# EAGLE design board (EAGLE 8.3.1)
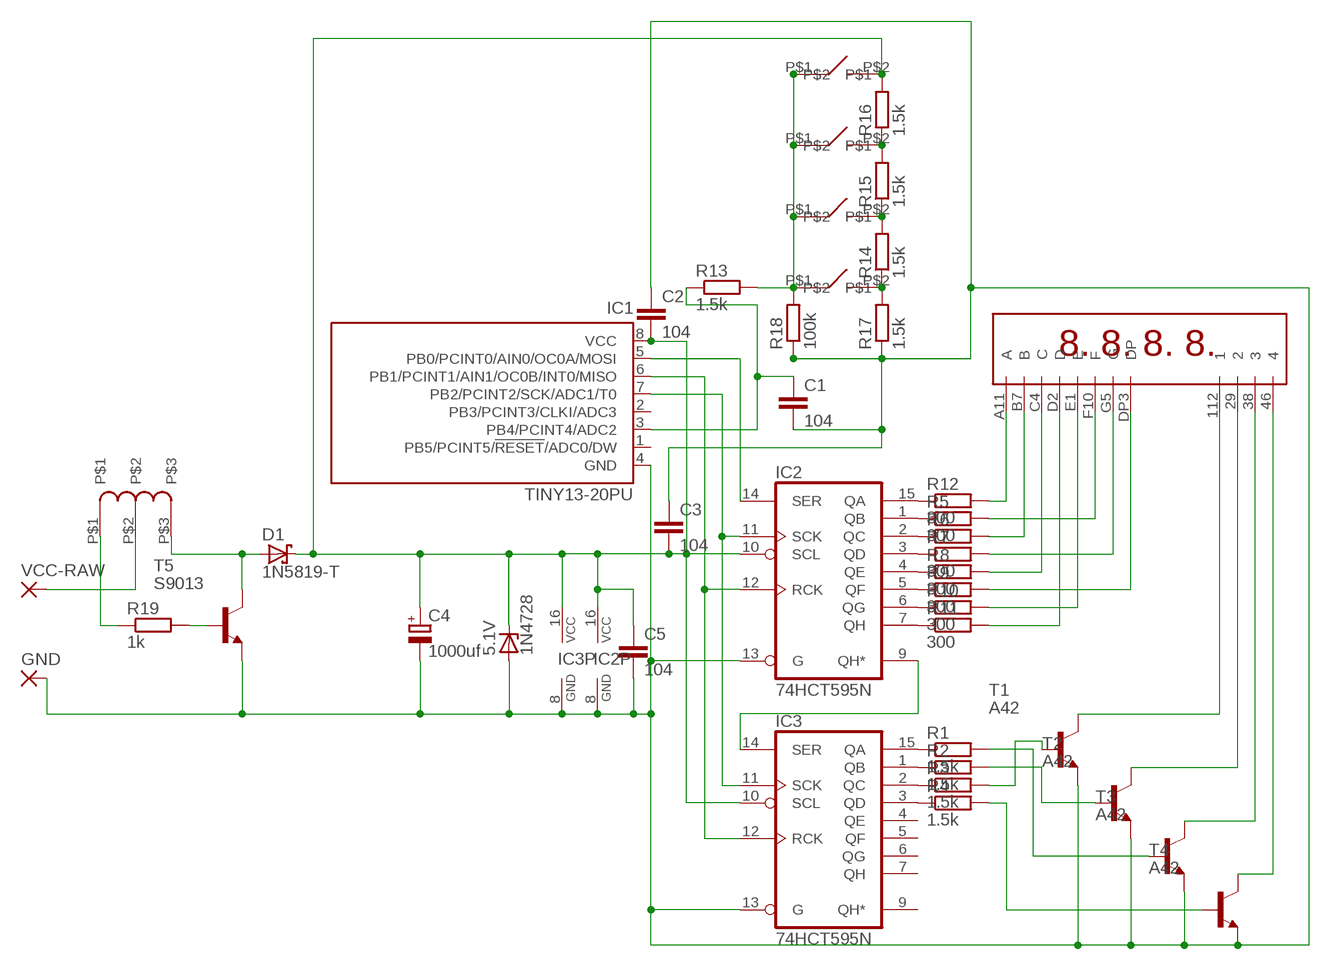
[diagram p0: schematic, sheet 1]

## Parts
5.1V  1N4728  [DO41Z10]
BTN1  BTN-6X6  [BTN-6X6]
BTN2  BTN-6X6  [BTN-6X6]
BTN3  BTN-6X6  [BTN-6X6]
BTN4  BTN-6X6  [BTN-6X6]
C1  104  C-EU050-025X075  [C050-025X075]
C2  104  C-EU050-025X075  [C050-025X075]
C3  104  C-EU050-025X075  [C050-025X075]
C4  1000uf  CPOL-EUE3.5-8  [E3,5-8]
C5  104  C-EU050-025X075  [C050-025X075]
D1  1N5819-T  [DO41-7.6]
GND  2,54/0,8  [2,54/0,8]
IC1  TINY13-20PU  [DIL08]
IC2  74HCT595N  [DIL16]
IC3  74HCT595N  [DIL16]
R1  1.5k  R-EU_0207/2V  [0207/2V]
R2  1.5k  R-EU_0207/2V  [0207/2V]
R3  1.5k  R-EU_0207/2V  [0207/2V]
R4  1.5k  R-EU_0207/2V  [0207/2V]
R5  300  R-EU_0207/2V  [0207/2V]
R6  R-EU_0207/2V  [0207/2V]
R7  300  R-EU_0207/2V  [0207/2V]
R8  300  R-EU_0207/2V  [0207/2V]
R9  300  R-EU_0207/2V  [0207/2V]
R10  300  R-EU_0207/2V  [0207/2V]
R11  300  R-EU_0207/2V  [0207/2V]
R12  300  R-EU_0207/2V  [0207/2V]
R13  1.5k  R-EU_0204/7  [0204/7]
R14  1.5k  R-EU_0204/7  [0204/7]
R15  1.5k  R-EU_0204/7  [0204/7]
R16  1.5k  R-EU_0204/7  [0204/7]
R17  1.5k  R-EU_0204/7  [0204/7]
R18  100k  R-EU_0204/7  [0204/7]
R19  1k  R-EU_0207/2V  [0207/2V]
T1  A42  MPSA42-NPN-TO92-EBC  [TO92-EBC]
T2  A42  MPSA42-NPN-TO92-EBC  [TO92-EBC]
T3  A42  MPSA42-NPN-TO92-EBC  [TO92-EBC]
T4  A42  MPSA42-NPN-TO92-EBC  [TO92-EBC]
T5  S9013  MPSA42-NPN-TO92-EBC  [TO92-EBC]
U$1  KL-5641-ASR  [KL-5641-ASR]
U$3  TRANS  [TRANS]
VCC-RAW  2,54/0,8  [2,54/0,8]

## Nets
GND: 5.1V.A C1.2 C2.1 C3.1 C4.- C5.2 GND.1(P) IC1.4(GND) IC2.8(GND) IC2.13(G) IC3.8(GND) IC3.13(G) R17.1 R18.1 T1.E T2.E T3.E T4.E T5.E
N$1: R10.2 U$1.E1(E)
N$2: R11.2 U$1.D2(D)
N$3: R9.2 U$1.DP3(DP)
N$4: R8.2 U$1.C4(C)
N$5: R7.2 U$1.G5(G)
N$6: R6.2 U$1.B7(B)
N$7: R5.2 U$1.F10(F)
N$8: R12.2 U$1.A11(A)
N$9: IC2.9(QH*) IC3.14(SER)
N$10: IC3.15(QA) R1.1
N$11: R1.2 T3.B
N$12: R2.2 T2.B
N$13: R4.2 T4.B
N$15: T1.C U$1.112
N$16: T2.C U$1.29
N$17: T3.C U$1.38
N$18: T4.C U$1.46
N$19: IC1.5(PB0/PCINT0/AIN0/OC0A/MOSI) IC2.14(SER)
N$22: D1.A T5.C U$3.P$3
N$23: IC3.1(QB) R2.1
N$24: IC3.2(QC) R3.1
N$25: IC3.3(QD) R4.1
N$26: R3.2 T1.B
N$27: IC2.7(QH) R11.1
N$28: IC2.6(QG) R10.1
N$29: IC2.5(QF) R9.1
N$30: IC2.4(QE) R8.1
N$31: IC2.3(QD) R7.1
N$32: IC2.2(QC) R6.1
N$33: IC2.1(QB) R5.1
N$34: IC2.15(QA) R12.1
N$35: C1.1 IC1.3(PB4/PCINT4/ADC2) R13.1
N$36: BTN1.P$1 BTN2.P$1 BTN3.P$1 BTN4.P$1 R13.2 R18.2
N$37: BTN4.P$2 R14.1 R17.2
N$38: BTN3.P$2 R14.2 R15.1
N$39: BTN2.P$2 R15.2 R16.1
N$41: R19.2 T5.B
N$43: R19.1 U$3.P$1
RCK: IC1.6(PB1/PCINT1/AIN1/OC0B/INT0/MISO) IC2.12(RCK) IC3.12(RCK)
SCK: IC1.7(PB2/PCINT2/SCK/ADC1/T0) IC2.11(SCK) IC3.11(SCK)
VCC: 5.1V.C BTN1.P$2 C2.2 C3.2 C4.+ C5.1 D1.C IC1.8(VCC) IC2.10(SCL) IC2.16(VCC) IC3.10(SCL) IC3.16(VCC) R16.2
VCC-RAW: U$3.P$2 VCC-RAW.1(P)
Unconnected: IC1.1(PB5/PCINT5/!RESET!/ADC0/DW) IC1.2(PB3/PCINT3/CLKI/ADC3) IC3.4(QE) IC3.5(QF) IC3.6(QG) IC3.7(QH) IC3.9(QH*)

## Library data of the parts
5.1V = diode:1N4728: Z DIODE 3.3 V, 1W, 5 percent
BTN1-BTN4 = mgvc:BTN-6X6
C1-C3 C5 = resistor:C-EU: CAPACITOR, European symbol
C4 = resistor:CPOL-EU: POLARIZED CAPACITOR, European symbol
D1 = diode:1N581*: 1.0A SCHOTTKY BARRIER RECTIFIER Source: http://www.diodes.com/datasheets/ds23001.pdf
GND VCC-RAW = wirepad:2,54/0,8: THROUGH-HOLE PAD
IC1 = atmel:TINY13: 8-bit AVR Microcontroller with 1K Bytes In-System Programmable Flash Source: http://www.atmel.com/dyn/resources/prod_documents/2535S.pdf; MPN: ATTINY13-20PU; OC_FARNELL: 9171550; OC_NEWARK: 96K6521
IC2 IC3 = 74xx-eu:74*595: 8-bit SHIFT REGISTER, output latch
R1-R19 = resistor:R-EU_: RESISTOR, European symbol
T1-T5 = transistor:*-NPN-: NPN Transistror BF959 corrected 2008.03.06
U$1 = mgvc:KL-5641-ASR: Индикатор 4 разряда 0.56" Красный, катод, черный фон KL-5641-ASR
U$3 = mgvc:TRANS

## Board
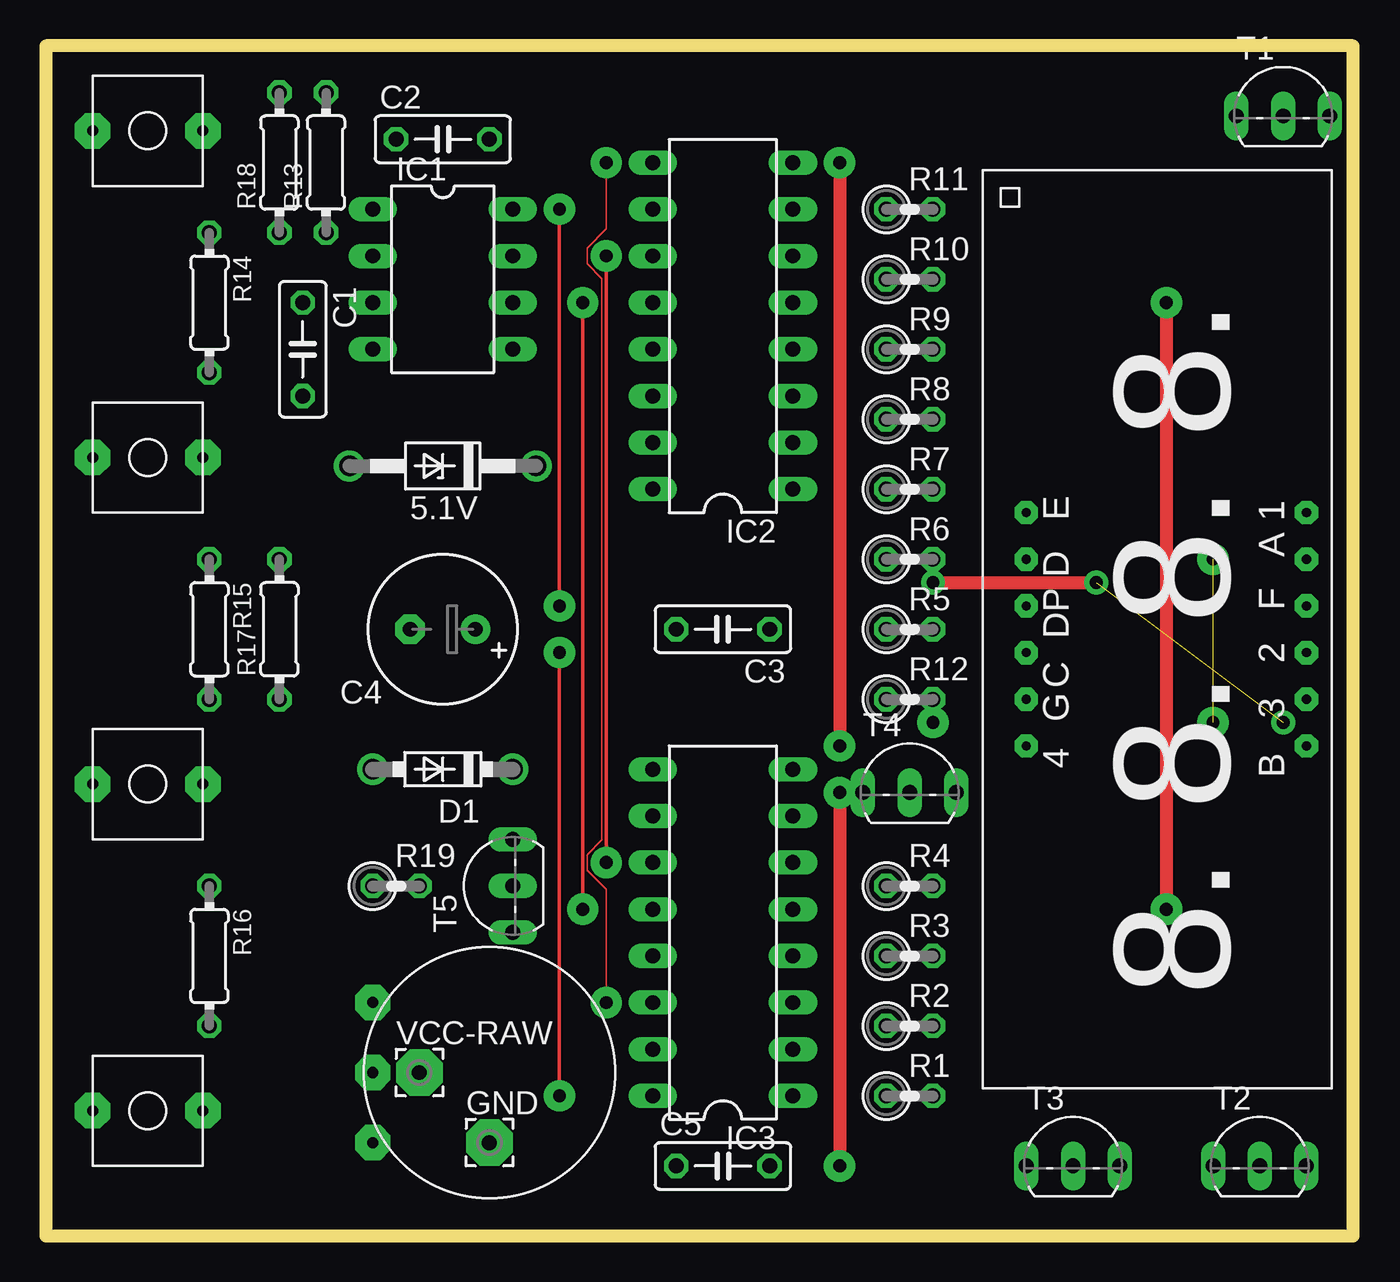
[diagram p1: board, top side]
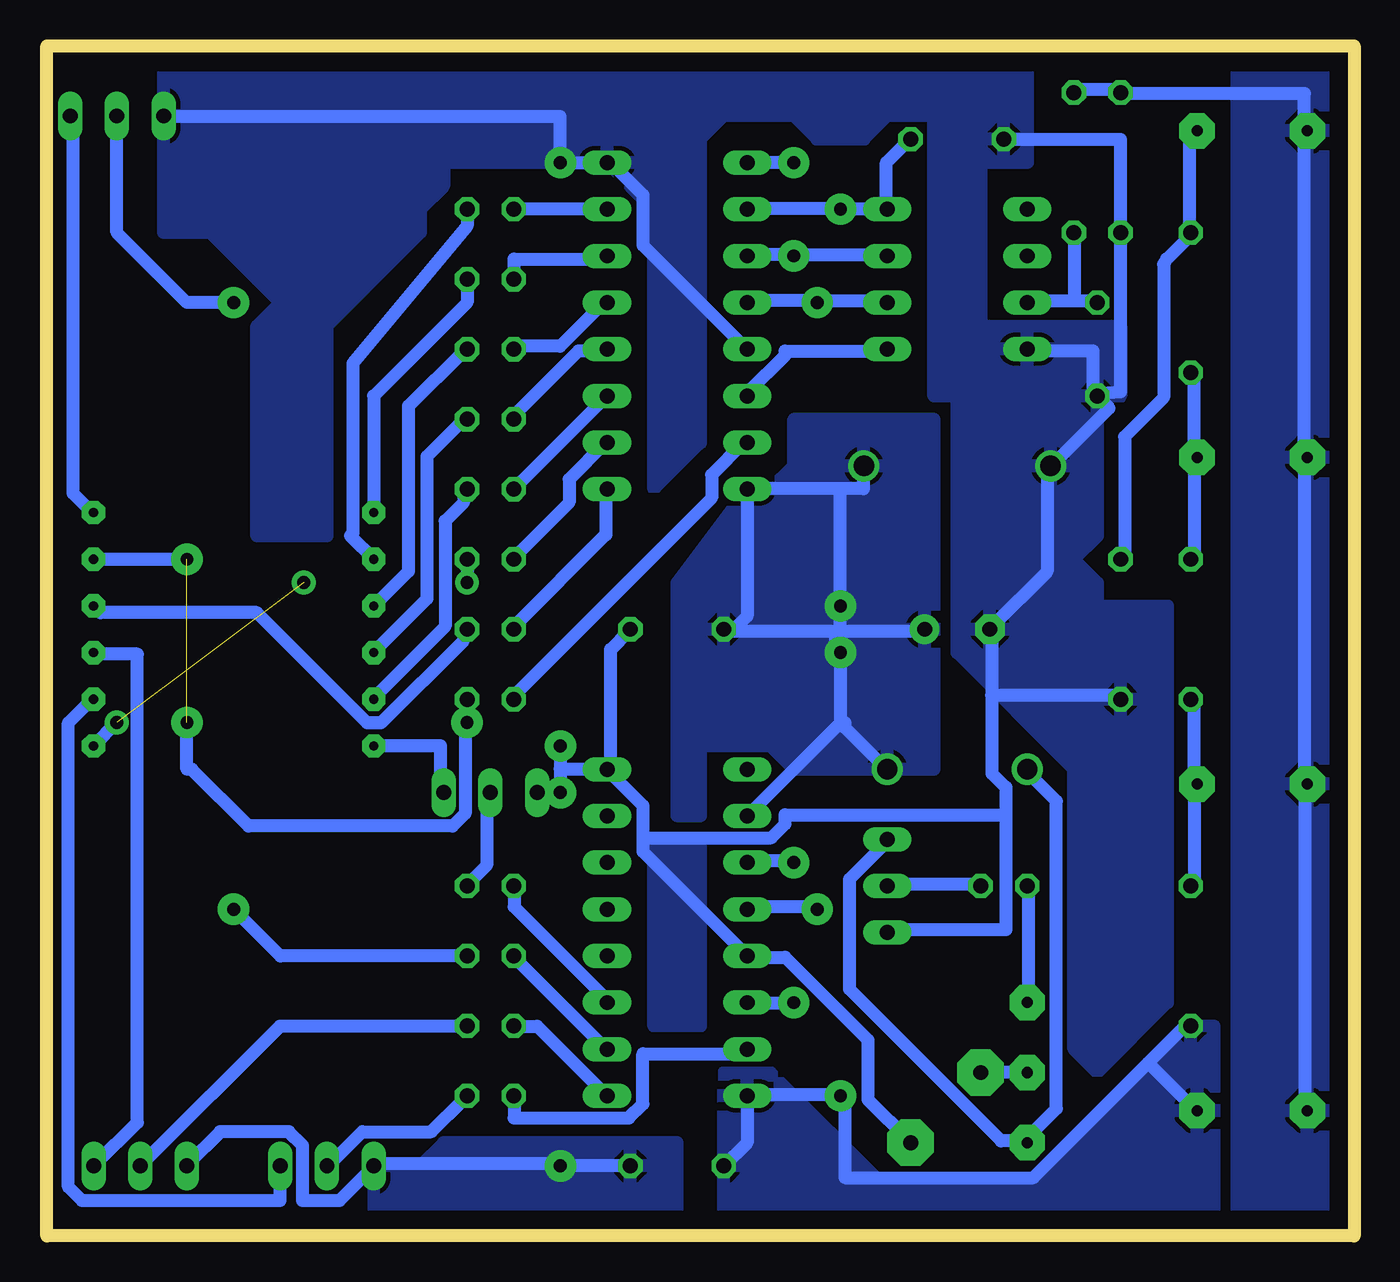
[diagram p2: board, bottom side, seen from below]

Size 71.12 x 64.77 mm. Coordinates in mm from the lower left corner, seen from the top.
Outline: 0,0 71.12,0 71.12,64.77 0,64.77 0,0
Copper layers (1*16): Top 0.035mm / dielectric 1.5mm / Bottom 0.035mm
Design rules "default *": minimum track width 0.7mm, minimum drill 0.35mm, track to track 6mil, track to pad 6mil, pad to pad 6mil, via to via 6mil, smd to smd 6mil, copper to edge 40mil, drill to drill 6mil, minimum pad ring 10mil, minimum via ring 8mil, stop-mask expansion 4mil, vias tented up to drill 0mil, thermal gap 10mil

### Footprints (pad centres in the part's own frame; a part is rotated, then mirrored left to right if it is on the bottom)
DO41Z10 = drill 1.118: A 5.08,0; C -5.08,0
BTN-6X6 = drill 0.6 pad 1.93 octagon: P$1 0,3; P$2 6,3
C050-025X075 = drill 0.813 octagon: 1 -2.54,0; 2 2.54,0
E3,5-8 = drill 0.813 pad 1.6: + -1.778,0 | drill 0.813 pad 1.6 octagon: - 1.778,0
DO41-7.6 = drill 1.1 pad 1.7: A 3.81,0; C -3.81,0
2,54/0,8 = drill 0.813 pad 2.54 octagon: 1 0,0
DIL08 = drill 0.813 long: 1 -3.81,-3.81; 2 -1.27,-3.81; 3 1.27,-3.81; 4 3.81,-3.81; 5 3.81,3.81; 6 1.27,3.81; 7 -1.27,3.81; 8 -3.81,3.81
DIL16 = drill 0.813 long: 1 -8.89,-3.81; 2 -6.35,-3.81; 3 -3.81,-3.81; 4 -1.27,-3.81; 5 1.27,-3.81; 6 3.81,-3.81; 7 6.35,-3.81; 8 8.89,-3.81; 9 8.89,3.81; 10 6.35,3.81; 11 3.81,3.81; 12 1.27,3.81; 13 -1.27,3.81; 14 -3.81,3.81; 15 -6.35,3.81; 16 -8.89,3.81
0207/2V = drill 0.813 octagon: 1 -1.27,0; 2 1.27,0
0204/7 = drill 0.813 octagon: 1 -3.81,0; 2 3.81,0
TO92-EBC = drill 0.813 long: B 0,-1.27; C 2.54,-1.27; E -2.54,-1.27
KL-5641-ASR = drill 0.5 pad 1.27 octagon: 29 1.27,7.62; 38 3.81,7.62; 46 6.35,-7.62; 112 -6.35,7.62; A11 -3.81,7.62; B7 6.35,7.62; C4 1.27,-7.62; D2 -3.81,-7.62; DP3 -1.27,-7.62; E1 -6.35,-7.62; F10 -1.27,7.62; G5 3.81,-7.62
TRANS = drill 0.6 pad 1.93 octagon: P$1 -6.35,3.81; P$2 -6.35,0; P$3 -6.35,-3.81

### Placement (x,y rotation side)
5.1V  21.59,41.91 180 top
BTN1  2.54,3.81 0 top
BTN2  2.54,21.59 0 top
BTN3  2.54,39.37 0 top
BTN4  2.54,57.15 0 top
C1  13.97,48.26 270 top
C2  21.59,59.69 0 top
C3  36.83,33.02 180 top
C4  21.59,33.02 180 top
C5  36.83,3.81 0 top
D1  21.59,25.4 180 top
GND  24.13,5.08 0 top
IC1  21.59,52.07 270 top
IC2  36.83,49.53 90 top
IC3  36.83,16.51 90 top
R1  46.99,7.62 0 top
R2  46.99,11.43 0 top
R3  46.99,15.24 0 top
R4  46.99,19.05 0 top
R5  46.99,33.02 0 top
R6  46.99,36.83 0 top
R7  46.99,40.64 0 top
R8  46.99,44.45 0 top
R9  46.99,48.26 0 top
R10  46.99,52.07 0 top
R11  46.99,55.88 0 top
R12  46.99,29.21 0 top
R13  15.24,58.42 90 top
R14  8.89,50.8 270 top
R15  8.89,33.02 270 top
R16  8.89,15.24 270 top
R17  12.7,33.02 90 top
R18  12.7,58.42 90 top
R19  19.05,19.05 0 top
T1  67.31,62.23 0 top
T2  66.04,5.08 0 top
T3  55.88,5.08 0 top
T4  46.99,25.4 0 top
T5  24.13,19.05 90 top
U$1  60.96,33.02 270 top
U$3  24.13,8.89 0 top
VCC-RAW  20.32,8.89 0 top

### Tracks (layer width: path | path; a pad name or v marks a point on that pad's centre or on a via)
GND  (via drill 0.7 pad 1.7)
  Top 0.7: v43.18,58.42 v43.18,26.67 | v43.18,24.13 v43.18,3.81
  Bottom 0.7: 18.95,22.92 18.95,24.42 19.7,25.17 19.7,29.44 | 18.95,22.92 18.95,16.67 25.2,16.67 T5.E | 19.7,29.44 19.7,32.92 C4.- 19.7,33.17 16.7,36.17 16.7,41.67 5.1V.A 16.45,41.92 13.32,45.05 13.95,45.67 | 13.95,45.67 14.1,45.82 12.7,45.94 R18.1 12.7,59.67 18.95,59.67 C2.1 | 12.7,29.42 R17.1 12.91,29.44 19.7,29.44 | 13.95,45.67 C1.2 14.2,45.92 14.2,48.17 17.7,48.17 IC1.4 | 38.7,21.67 38.7,23.42 40.45,25.17 IC3.8 | 38.7,21.67 38.7,20.92 IC3.13 32.7,15.17 30.95,15.17 26.45,10.67 26.45,7.42 24.2,5.17 GND.1 | C3.1 39.45,32.92 40.45,31.92 40.45,25.67 IC3.8 | T4.E 44.45,24.17 43.2,24.17 v43.18,24.13 43.2,24.42 43.2,25.42 | IC2.13 33.2,48.42 38.7,53.92 38.7,56.67 40.45,58.42 IC2.8 v43.18,58.42 43.2,58.42 43.2,60.92 64.7,60.92 T1.E | 43.2,25.42 43.2,26.67 v43.18,26.67 | 43.2,25.42 40.95,25.42 IC3.8 | 18.95,22.92 30.95,22.92 30.95,22.42 31.7,21.67 38.7,21.67 | 19.73,29.44 19.7,29.44 | T2.E 63.45,3.92 61.7,5.67 57.95,5.67 57.2,4.92 57.2,1.92 55.2,1.92 53.45,3.67 T3.E 53.2,3.92 43.2,3.92 v43.18,3.81 C5.2
  pour Bottom: 64.77,54.61 64.77,63.5 17.78,63.5 17.78,58.42 20.32,58.42 20.32,49.53 12.7,49.53 12.7,45.72 13.97,44.45 13.97,38.1 15.24,36.83 13.97,35.56 13.97,34.29 11.43,34.29 10.16,34.29 10.16,12.7 13.97,8.89 15.24,10.16 15.24,25.4 21.59,31.75 21.59,45.72 22.86,45.72 22.86,60.96 25.4,60.96 26.67,59.69 29.21,59.69 30.48,60.96 34.29,60.96 35.56,59.69 35.56,43.18 38.1,40.64 38.1,55.88 39.37,57.15 40.64,58.42 49.53,58.42 49.53,57.15 50.8,55.88 50.8,54.61 55.88,49.53 55.88,38.1 59.69,38.1 59.69,49.53 58.42,50.8 59.69,52.07 62.23,54.61
  pour Bottom: 53.34,1.27 36.83,1.27 36.83,5.08 49.53,5.08 50.8,3.81 53.34,3.81
  pour Bottom: 35.56,21.59 35.56,11.43 38.1,11.43 38.1,21.59
N$1
  Bottom 0.7: R10.2 48.26,50.8 53.34,45.72 U$1.E1
N$2
  Bottom 0.7: R11.2 48.26,54.98 54.48,47.5 54.48,38.23 54.61,38.1 U$1.D2
N$3
  Bottom 0.7: U$1.DP3 53.2,34.42 51.45,36.17 51.45,45.17 48.45,48.17 R9.2
N$4
  Bottom 0.7: U$1.C4 53.2,31.92 50.45,34.67 50.45,42.42 48.45,44.42 R8.2
N$5
  Bottom 0.7: U$1.G5 53.2,29.42 49.45,33.17 49.45,38.92 48.45,39.92 48.45,40.42 R7.2
N$6  (via drill 0.7 pad 1.3)  (1 unrouted)
  Top 0.7: v48.26,35.56 v57.15,35.56
  Bottom 0.7: R6.2 v48.26,35.56 | v67.31,27.94 U$1.B7
N$7
  Bottom 0.7: U$1.F10 68.45,34.17 68.2,33.92 59.7,33.92 53.7,27.92 52.95,27.92 48.45,32.42 48.45,32.92 R5.2
N$8  (via drill 0.7 pad 1.7)  (1 unrouted)
  Bottom 0.7: U$1.A11 v63.5,36.83 | v63.5,27.94 63.5,25.4 63.23,25.4 60.14,22.31 49.05,22.31 48.37,22.99 48.37,27.83 v48.26,27.94 R12.2
N$9  (via drill 0.7 pad 1.7)
  Top 0.076: v30.48,12.7 30.48,18.85 29.44,19.89 29.44,20.75 30.25,21.56 30.25,52.1 29.44,52.91 29.44,53.77 30.48,54.81 v30.48,58.42
  Bottom 0.7: IC3.14 32.95,12.67 30.7,12.67 v30.48,12.7 | v30.48,58.42 IC2.9
N$10
  Bottom 0.7: IC3.15 33.2,9.92 38.7,9.92 38.7,7.17 39.45,6.42 45.7,6.42 45.7,7.42 R1.1
N$11
  Bottom 0.7: R1.2 48.45,7.42 50.2,5.67 53.95,5.67 55.7,3.92 T3.B
N$12
  Bottom 0.7: T2.B 65.95,3.92 58.45,11.42 48.45,11.42 R2.2
N$13
  Bottom 0.7: R4.2 48.2,19.17 47.2,20.17 47.2,23.92 T4.B
N$15
  Bottom 0.7: U$1.112 68.7,39.42 69.7,40.42 69.7,60.92 T1.C
N$16
  Bottom 0.7: U$1.29 68.45,31.67 66.2,31.67 66.2,6.17 68.45,3.92 T2.C
N$17
  Bottom 0.7: U$1.38 68.7,29.17 69.95,27.92 69.95,2.67 69.2,1.92 58.45,1.92 58.45,3.67 T3.C
N$18
  Bottom 0.7: U$1.46 49.7,26.67 49.7,24.17 T4.C
N$19
  Bottom 0.7: IC1.5 25.45,48.17 30.95,48.17 30.95,47.92 32.95,45.92 IC2.14
N$22
  Bottom 0.7: T5.C 25.45,21.42 27.45,19.42 27.45,13.42 19.2,5.17 17.95,5.17 U$3.P$3 17.7,5.42 16.2,6.92 16.2,23.67 17.7,25.17 D1.A
N$23
  Bottom 0.7: IC3.1 40.7,7.67 44.45,11.42 45.7,11.42 R2.1
N$24
  Bottom 0.7: IC3.2 40.7,10.17 45.7,15.17 R3.1
N$25
  Bottom 0.7: IC3.3 40.7,12.92 45.7,17.92 45.7,18.92 R4.1
N$26  (via drill 0.7 pad 1.7)
  Top 0.7: v60.96,50.8 v60.96,17.78
  Bottom 0.7: 48.45,15.42 R3.2 58.42,15.24 v60.96,17.78 | 67.2,60.92 T1.B 67.31,54.61 63.5,50.8 v60.96,50.8
N$27
  Bottom 0.7: IC2.7 40.7,55.92 45.7,55.92 R11.1
N$28
  Bottom 0.7: IC2.6 40.7,53.17 45.7,53.17 45.7,52.17 R10.1
N$29
  Bottom 0.7: R9.1 45.7,48.42 43.2,48.42 40.7,50.92 IC2.5
N$30
  Bottom 0.7: R8.1 45.7,44.67 42.2,48.17 40.7,48.17 IC2.4
N$31
  Bottom 0.7: R7.1 45.7,40.67 40.7,45.67 IC2.3
N$32
  Bottom 0.7: R6.1 45.7,36.92 42.7,39.92 42.7,41.17 40.7,43.17 IC2.2
N$33
  Bottom 0.7: R5.1 45.7,33.17 40.7,38.17 40.7,40.42 IC2.1
N$34
  Bottom 0.7: R12.1 45.7,29.42 34.95,40.17 34.95,41.42 33.2,43.17 IC2.15
N$35
  Bottom 0.7: 15.2,50.92 17.7,50.92 IC1.3 | 15.2,50.92 14.2,50.92 C1.1 | 15.2,50.92 15.2,54.42 R13.1
N$36
  Bottom 0.7: R13.2 15.2,62.42 12.7,62.42 R18.2 12.45,62.17 2.7,62.17 2.7,60.17 BTN4.P$1 2.7,59.92 2.7,42.67 BTN3.P$1 2.7,42.17 2.7,24.67 BTN2.P$1 | 2.45,24.42 BTN2.P$1 | BTN1.P$1 2.69,6.85 2.69,24.33 BTN2.P$1
  pour Bottom: 6.35,1.27 6.35,63.5 1.27,63.5 1.27,1.27
N$37
  Bottom 0.7: 12.7,36.67 R17.2 12.49,37.11 12.49,43.51 10.36,45.64 10.36,52.88 10.2,53.17 8.95,54.42 R14.1 8.95,54.92 8.95,59.67 8.7,59.92 BTN4.P$2
N$38
  Bottom 0.7: R15.1 8.7,36.92 8.7,42.17 BTN3.P$2 8.7,42.67 8.7,46.92 R14.2
N$39
  Bottom 0.7: R16.1 8.7,19.17 8.7,24.42 BTN2.P$2 8.7,24.92 8.7,29.17 R15.2
N$41
  Bottom 0.7: R19.2 20.45,19.17 25.2,19.17 T5.B
N$43
  Bottom 0.7: R19.1 17.7,18.92 17.7,12.92 U$3.P$1
RCK  (via drill 0.7 pad 1.7)
  Top 0.2: v29.21,50.8 v29.21,17.78
  Bottom 0.7: IC3.12 32.95,17.92 29.45,17.92 v29.21,17.78 | IC1.6 25.45,50.92 29.2,50.92 v29.21,50.8 29.45,50.92 32.95,50.92 IC2.12
SCK  (via drill 0.7 pad 1.7)
  Top 0.2: v30.48,53.34 v30.48,20.32
  Bottom 0.7: IC3.11 32.95,20.42 30.7,20.42 v30.48,20.32 | IC1.7 25.45,53.42 30.45,53.42 v30.48,53.34 30.7,53.42 32.95,53.42 IC2.11
VCC  (via drill 0.7 pad 1.7)
  Top 0.2: v27.94,7.62 v27.94,31.75 | v27.94,34.29 v27.94,55.88
  Bottom 0.7: 27.95,40.67 26.7,40.67 26.7,41.67 5.1V.C | 27.95,40.67 32.95,40.67 IC2.16 33.02,33.73 33.83,32.92 | C2.2 24.2,59.67 25.45,58.42 25.45,56.17 IC1.8 25.45,55.92 27.7,55.92 v27.94,55.88 28.2,55.92 32.95,55.92 IC2.10 | 27.95,40.67 27.95,34.42 v27.94,34.29 27.95,34.17 27.95,32.92 | 27.95,27.92 32.95,22.92 IC3.10 | 27.95,27.92 27.95,31.67 v27.94,31.75 28.2,31.92 28.2,32.92 | 33.83,32.92 28.2,32.92 | 33.83,32.92 34.2,32.92 C3.2 | 27.95,32.92 23.45,32.92 C4.+ | 27.95,32.92 28.2,32.92 | D1.C 25.45,25.42 27.7,27.67 27.7,27.92 27.95,27.92 | 11.21,9.41 17.45,3.17 27.7,3.17 27.7,7.42 v27.94,7.62 27.95,7.67 32.95,7.67 IC3.16 33.02,5.08 C5.1 | 11.21,9.41 9.2,11.42 R16.2 | 11.21,9.41 8.65,6.85 BTN1.P$2 | 11.21,9.41
  pour Bottom: 33.02,40.64 31.75,40.64 30.48,41.91 30.48,44.45 22.86,44.45 22.86,25.4 30.48,25.4 31.75,26.67 35.56,26.67 35.56,22.86 36.83,22.86 36.83,35.56
  pour Bottom: 7.62,11.43 7.62,1.27 34.29,1.27 34.29,8.89 31.75,8.89 25.4,2.54 17.78,2.54 8.89,11.43
VCC-RAW
  Bottom 0.7: U$3.P$2 17.95,8.92 20.2,8.92 VCC-RAW.1